# Altium project Shield_board.PrjPcb
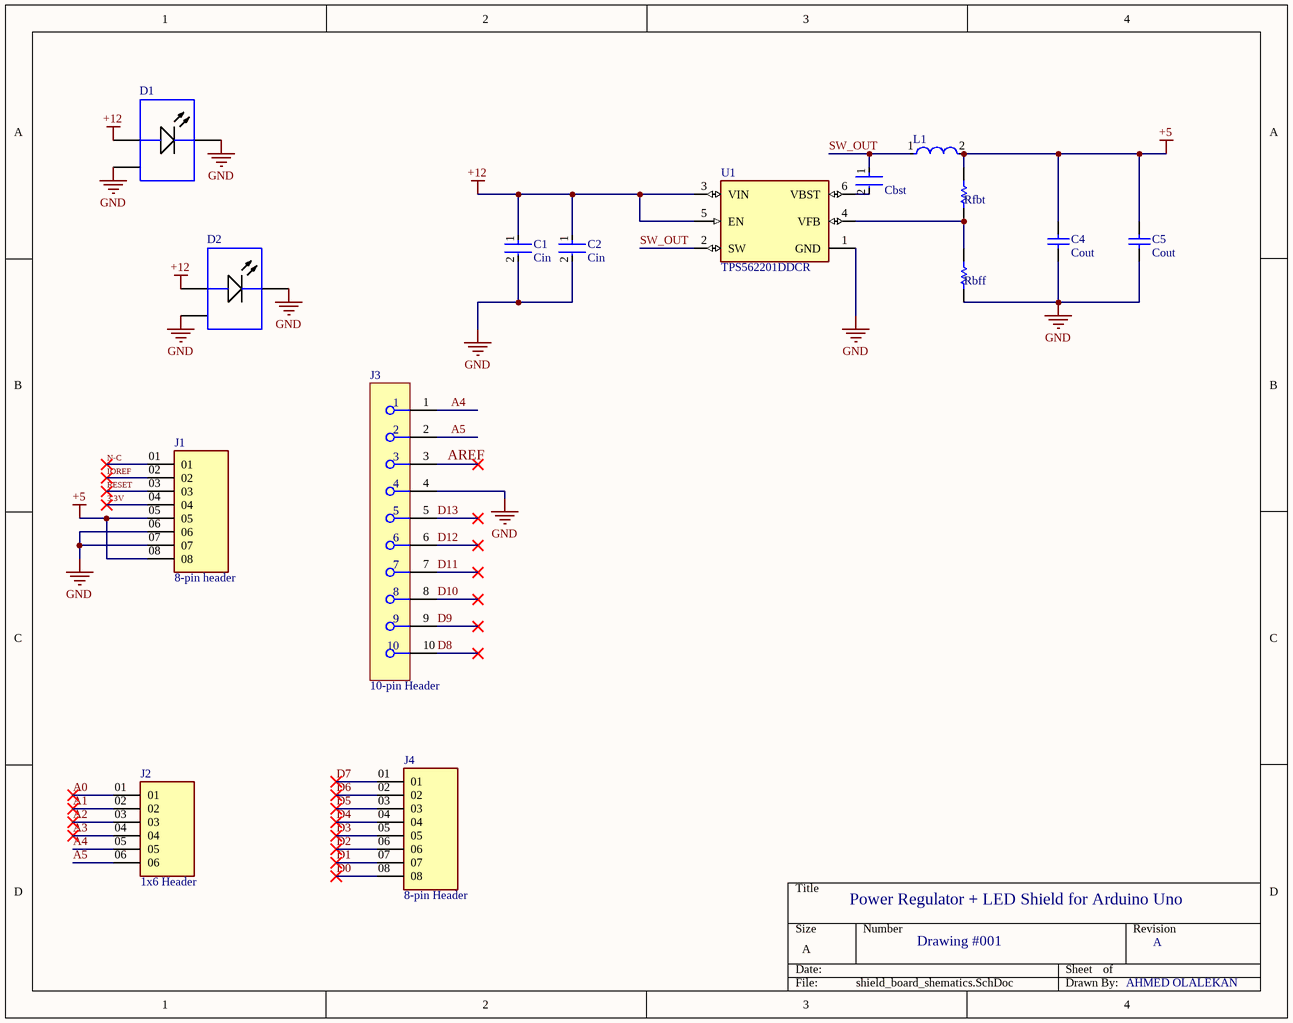
[diagram p0: shield_board_shematics.SchDoc]
1 sheet, 15 parts. Net scope: global (net labels, ports and power ports of the same name join across sheets).
Board file: shield_boardPCB.PcbDoc

## Sheet shield_board_shematics.SchDoc
size A; SheetNumber: 1; SheetTotal: 1

### Parts
C1  Cin  [FP-GRM21B-0_2-e0_2_0_7-MFG]
C2  Cin  [FP-GRM21B-0_2-e0_2_0_7-MFG]
C3  Cbst  [FP-0805-L_2_01_0_2-W_1_25-IPC_C]
C4  Cout  [CAPC1608X100X20ML10]
C5  Cout  [CAPC1608X100X20ML10]
D1  MKRAWT-00-0000-0D0HG235H  [CREE-MK-R-2_V]  (value not drawn)
D2  MKRAWT-00-0000-0D0HG235H  [CREE-MK-R-2_V]  (value not drawn)
J1  8-pin header  [SAMTEC_SSQ-108-03-X-S]
J2  1x6 Header  [SAMTEC_SSQ-106-03-X-S]
J3  10-pin Header  [FP-SSQ-110-03-T-S-MFG]
J4  8-pin Header  [SAMTEC_SSQ-108-03-X-S]
L1  NRS8030T3R3MJGJ  [FP-NRS8030-MFG]  (value not drawn)
R1  Rfbt  [RESC1005X40X25LL05T05]
R2  Rbff  [RESC0603X28X15NL05T05]
U1  TPS562201DDCR  [FP-DDC0006A-IPC_C]

### Nets
+5: C4.2 C5.2 J1.05 J1.08 L1.2 R1.2
+12: C1.1 C2.1 D1.1(A) D2.1(A) U1.3(VIN) U1.5(EN)
GND: C1.2 C2.2 C4.1 C5.1 D1.2(K) D1.3(EP) D2.2(K) D2.3(EP) J1.06 J1.07 J3.4 R2.1 U1.1(GND)
3.3V: J1.04
A0: J2.01
A1: J2.02
A2: J2.03
A3: J2.04
A4: J2.05 J3.1
A5: J2.06 J3.2
AREF: J3.3
D0: J4.08
D1: J4.07
D2: J4.06
D3: J4.05
D4: J4.04
D5: J4.03
D6: J4.02
D7: J4.01
D8: J3.10
D9: J3.9
D10: J3.8
D11: J3.7
D12: J3.6
D13: J3.5
IOREF: J1.02
N-C: J1.01
RESET: J1.03
SW_OUT: C3.1 L1.1 U1.2(SW)
NetC3_2: C3.2 U1.6(VBST)
NetR1_1: R1.1 R2.2 U1.4(VFB)

### Notes on the sheet
- Power Regulator + LED Shield for Arduino Uno
- Drawing #001
- A
- AHMED OLALEKAN

### Library data of the parts
C1 C2 = CMP-06035-048920-1: Chip Multilayer Ceramic Capacitors for General Purpose, 0805, 10uF, X5R, 15%, 10%, 35V; Max Operating Temperature: 85°C; REACH SVHC: No SVHC; Packaging: Tape and Reel; Thickness: 0.057inch; Tolerance: 10%; Capacitance: 10uF; Case Code (Imperial): 0805; Height: 1.25mm; Width: 0.049inch; Length: 0.079inch; Lead Free: Lead Free; Voltage Rating: 35V; Case/Package: 0805; Dielectric: X5R; Min Operating Temperature: -55°C; Package Quantity: 3000; Termination: SMD/SMT; Case Code (Metric): 2012; Weight: 0.000335oz; Mount: Surface Mount; Voltage Rating (DC): 35V
C3 = CMP-2000-05014-2: General Purpose Ceramic Capacitor, 0805, 100nF, 10%, X7R, 0.15, 25V; Dissipation Factor: 3%; Insulation Resistance: 100GR; Tolerance: 10%; Height: 0.94mm; Case/Package: 0805; Case Code (Imperial): 0805; Number of Pins: 2; Termination: SMD/SMT; Case Code (Metric): 2012; Depth: 1.25mm; Min Operating Temperature: -55°C; Radiation Hardening: No; Max Operating Temperature: 125°C; Length: 2.01mm; Thickness: 0.037inch; Series: -; Dielectric: X7R; Voltage Rating (DC): 25V; Packaging: Tape and Reel; Width: 0.049inch; Capacitance: 100nF; Construction: Flat; Voltage: 25V; RoHS Compliant: Yes; REACH SVHC: No SVHC; Package Quantity: 1; Voltage Rating: 25V; Mount: Surface Mount; Lead Free: Lead Free; Contact Plating: Tin
C4 C5 = CMP-2000-05441-1: Chip Capacitor, 22 uF, +/- 20%, 10 V, -55 to 85 degC, 0603 (1608 Metric), RoHS, Tape and Reel; Manufacturer: TDK; PCN Part Number: MLCCPartNumberChange30/Nov/2012; Voltage - Rated: 10V; Product Training Modules: CSeriesGeneralApplicationsSEAT,CCV,andTVCLDesignToolsGuidetoReplacinganElectrolyticCapacitorwithanMLCC; Other Names: 445-9077-1; Design Resources: 20WNon-IsolatedBuckLEDDriverUsingPLLNK460KG; Online Catalog: CSeries,GeneralPurpose; Capacitance: 22µF; Temperature Coefficient: X5R; Kits: 445-9014-KIT-ND-KITMLCC100PF-22UF060310-50V; Packaging: CutTape(CT); Standard Package: 1; Package / Case: 0603(1608Metric); Lead Style: -; Features: -; Ratings: -; Operating Temperature: -55degC~85degC; Applications: GeneralPurpose; Package Reference: 603; Datasheet URL: http://download.siliconexpert.com/pdfs/2015/4/21/15/54/45/779/tdk_/manual/37024850441143360mlcc_commercial_general_en.pdf; Datasheet Version: Mar-15; Mounting Type: SurfaceMount,MLCC; Lead Spacing: -; Size / Dimension: 0.063"Lx0.031"W(1.60mmx0.80mm); Height - Seated (Max): -; Package Description: 2-Pin Surface Mount Device, Body 1.6 x 0.8 mm; Manufacturer URL: http://www.tdk.com/; RoHS Information: RoHSCertificate-MLCC; Tolerance: ±20%; Series: C; Thickness (Max): 0.035"(0.90mm); Family: CeramicCapacitors; Category: Capacitors
D1 D2 = CMP-2100-00977-1: LED, White, 12 V, 2-Pin SMD, RoHS, Tape and Reel
J1 J4 = SSQ-108-03-X-S: SSQ - Samtec 2.54mm Square Tail Single Row Socket Strip 8.5mm Profile - Fast Stock; MP: SSQ-108-03-T-S; SnapEDA_Link: https://www.snapeda.com/parts/SSQ-108-03-T-S/Samtec/view-part/?ref=snap; Package: None; Value: *; MF: Samtec; Check_prices: https://www.snapeda.com/parts/SSQ-108-03-T-S/Samtec/view-part/?ref=eda
J2 = SSQ-106-03-X-S: SSQ - Samtec 2.54mm Square Tail Single Row Socket Strip 8.5mm Profile - Fast Stock; MF: Samtec Inc.; MP: SSQ-106-03-T-S; SnapEDA_Link: https://www.snapeda.com/parts/SSQ-106-03-T-S/Samtec+Inc./view-part/?ref=snap; Package: None; Value: *; Check_prices: https://www.snapeda.com/parts/SSQ-106-03-T-S/Samtec+Inc./view-part/?ref=eda
J3 = CMP-00575-00295916-2: SSQ-110-03-T-S Headers & Wire Housings Tiger Buy Socket Strip with Square Tails, 0.100 Pitch; Manufacturer Lifecycle Status: PRODUCTION; Voltage Rating (DC): 655V; Number of Contacts: 10; Pitch: 2.54mm; Connector Type: Receptacle, Socket; Current Rating: 6.3A; Voltage Rating (AC): 465V; Min Operating Temperature: -55°C; Lifecycle Status: Production; Contact Material: Nickel, Tin; Radiation Hardening: No; Max Operating Temperature: 105°C; Termination: Solder; Width: 2.41mm; Housing Color: Black; Height: 8.64mm; Number of Rows: 1; Packaging: Bulk; Mount: Through Hole; Lead Free: Lead Free; Number of Pins: 10; Color: Black; Voltage Rating: 655V; Contact Plating: Tin; Housing Material: Plastic; Number of Positions: 10; RoHS: Compliant; Length: 25.9mm
L1 = CMP-14484-000405-1: Inductor Power Shielded Wirewound 3.3uH 20% 100KHz Ferrite 4.2A 24.7mΩ DCR T/R; Current Rating: 4.3A; DC Resistance (DCR): 19mR; Self Resonant Frequency: 50MHz; Height: 3mm; Lead Free: Lead Free; Saturation Current: 4.2A; Termination: SMD/SMT; RoHS Compliant: Yes; Resistor Type: Wirewound; RMS Current (Irms): 4.3A; Series: NRS; Halogen Free: Halogen Free; Shielding: Shielded; Length: 8mm; Max DC Current: 4.2A; Height - Seated (Max): 0.118inch; Radiation Hardening: No; Min Operating Temperature: -25°C; Number of Pins: 2; Core Material: Ferrite; Inductance: 3.3uH; Package Quantity: 1000; REACH SVHC: No SVHC; Test Frequency: 100kHz; Tolerance: 20%; Case/Package: Nonstandard; Inductance Tolerance: 20%; Width: 0.315inch; Mount: Surface Mount; Depth: 8.2mm; Lead Pitch: 5.6mm; Packaging: Tape and Reel; Max Operating Temperature: 125°C
R1 = CMP-2000-07588-1: Chip Resistor, 10 KOhm, +/- 1%, 0.1 W, -55 to 155 degC, 0402 (1005 Metric), RoHS, Tape and Reel; Manufacturer: Panasonic; Power Rating: 100mW; Voltage Rating: 50V; Resistance: 10KOhm; Case\/Package: 0402; Temperature Coefficient: 100ppm\/degreesC; RoHSCompliant: True; Lead Free: LeadFree; Package Quantity: 1; Contact Plating: Tin; Length: 1mm; Radiation Hardening: No; REACH SVHC: NoSVHC; Max Operating Temperature: 155degC; Depth: 0.5mm; Case Code (Imperial): 0402; Military Standard: Not; Package Description: 2-Pin Surface Mount Device, Body 1 x 0.5 mm; Termination: SMD/SMT; Case Code (Metric): 1005; Height: 0.35mm; Packaging: TapeandReel; Voltage Rating (DC): 50V; Package Reference: 402; Number of Pins: 2; Tolerance: 1%; Mounting Technology: SurfaceMount; Width: 0.02inch; Mount: SurfaceMount; Datasheet URL: https://industrial.panasonic.com/cdbs/www-data/pdf/RDA0000/AOA0000C304.pdf; Composition: ThickFilm; Datasheet Version: 02/2017; Manufacturer URL: http://www.panasonic.com/; Max Power Dissipation: 100mW; Number of Terminations: 2; Min Operating Temperature: -55degC
R2 = CMP-2004-00723-1: Manufacturer: Vishay Dale; Part Number: CRCW020156K2FNED
U1 = CMP-04918-000361-1: IC REG BUCK ADJ 2A TSOT23-6; Switching Frequency: 580kHz; Max Input Voltage: 17V; Number of Outputs: 1; Output Voltage: 7V; Output Type: Adjustable; Quiescent Current: 400uA; Min Input Voltage: 4.5V; Mount: Surface Mount; Max Operating Temperature: 125°C; Lead Free: Lead Free; Operating Supply Voltage: 17V; Number of Pins: 6; RoHS Compliant: Yes; Contact Plating: Tin; Min Operating Temperature: -40°C; Case/Package: SOT; Max Output Current: 2A